# Altium project H19R1.PrjPcb
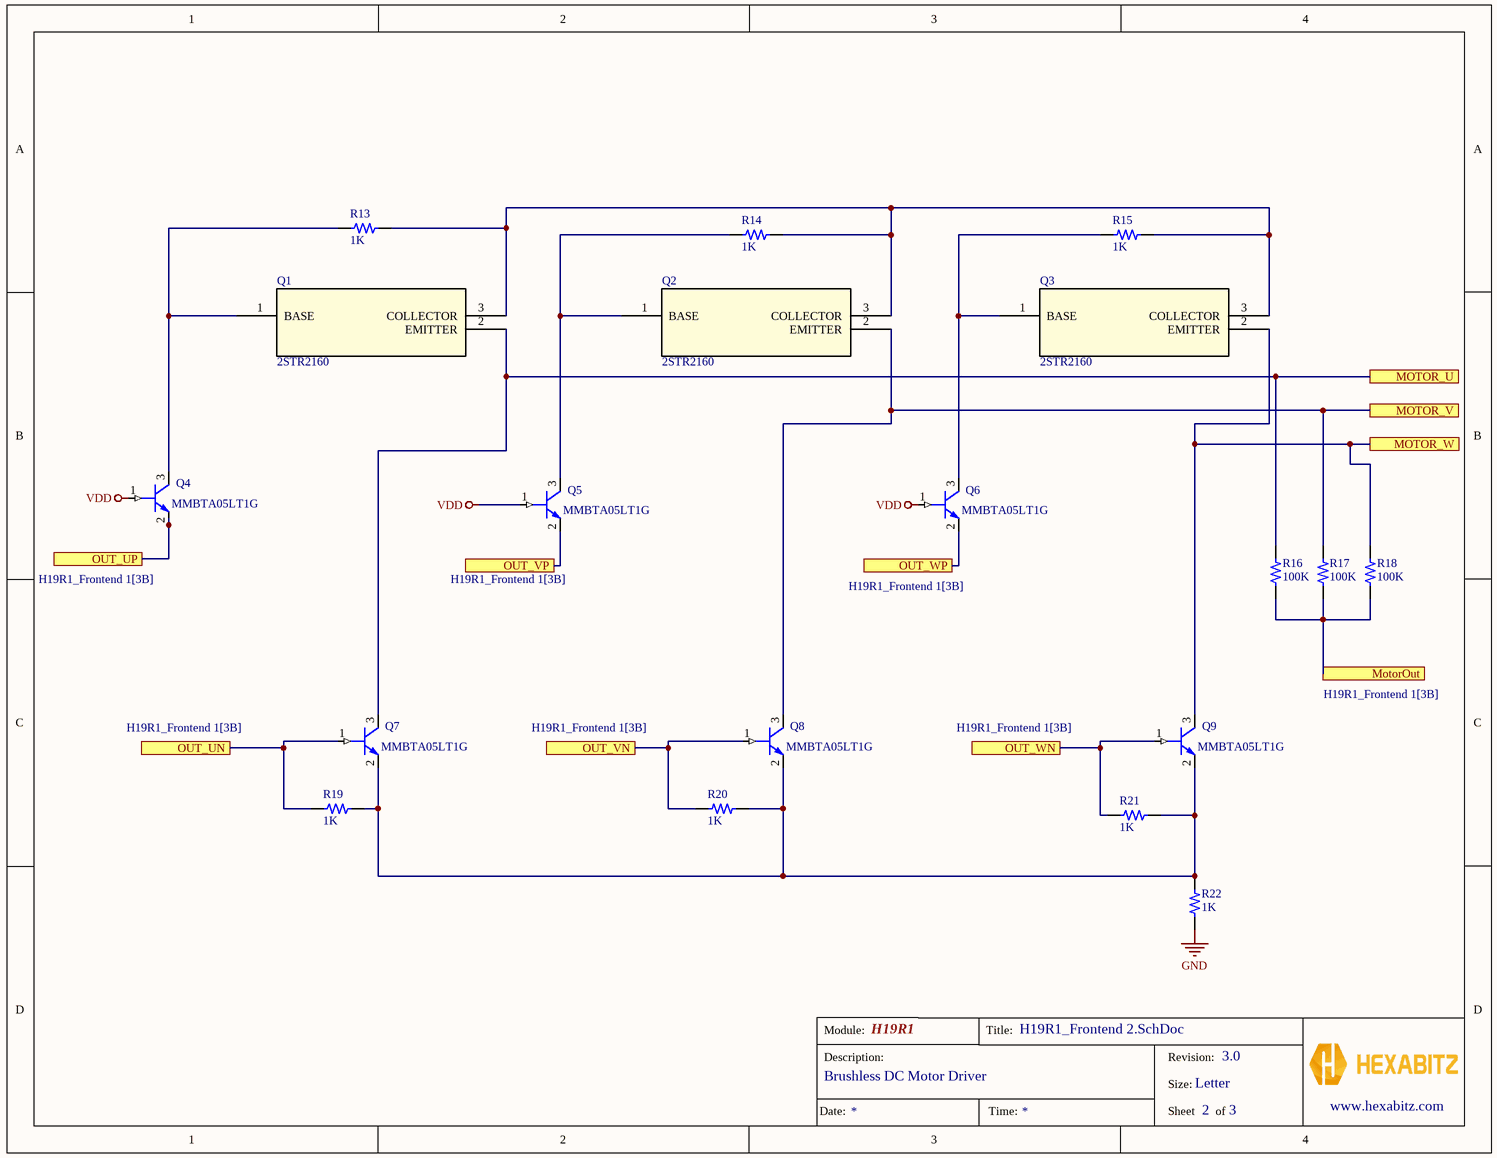
[diagram p0: H19R1_Frontend 2.SchDoc]
revision: 3.0; Module_Name: H19R1; Module_Description: Brushless DC Motor Driver
1 sheet, 19 parts. Net scope: flat (ports and power ports of the same name join across sheets).
Board file: H19R1.PcbDoc

## Sheet H19R1_Frontend 2.SchDoc
size Letter; CompanyName: Hexabitz; DocumentNumber: 2; SheetNumber: 2; SheetTotal: 3

### Parts
Q1  2STR2160  [SOT23_3P04X1P75X1P9_STM]
Q2  2STR2160  [SOT23_3P04X1P75X1P9_STM]
Q3  2STR2160  [SOT23_3P04X1P75X1P9_STM]
Q4  MMBTA05LT1G  [SOT-23]
Q5  MMBTA05LT1G  [SOT-23]
Q6  MMBTA05LT1G  [SOT-23]
Q7  MMBTA05LT1G  [SOT-23]
Q8  MMBTA05LT1G  [SOT-23]
Q9  MMBTA05LT1G  [SOT-23]
R13  value 1K  [R0402_3]  (hidden comment: RC0402FR-071KL)
R14  value 1K  [R0402_3]  (hidden comment: RC0402FR-071KL)
R15  value 1K  [R0402_3]  (hidden comment: RC0402FR-071KL)
R16  value 100K  [R0402_3]  (hidden comment: ERJ-2RKF1003X)
R17  value 100K  [R0402_3]  (hidden comment: ERJ-2RKF1003X)
R18  value 100K  [R0402_3]  (hidden comment: ERJ-2RKF1003X)
R19  value 1K  [R0402_3]  (hidden comment: RC0402FR-071KL)
R20  value 1K  [R0402_3]  (hidden comment: RC0402FR-071KL)
R21  value 1K  [R0402_3]  (hidden comment: RC0402FR-071KL)
R22  value 1K  [R0402_3]  (hidden comment: RC0402FR-071KL)

### Ports
MOTOR_U, MOTOR_V, MOTOR_W, MotorOut (see H19R1_Frontend 1[3B]), OUT_UN (see H19R1_Frontend 1[3B]), OUT_UP (see H19R1_Frontend 1[3B]), OUT_VN (see H19R1_Frontend 1[3B]), OUT_VP (see H19R1_Frontend 1[3B]), OUT_WN (see H19R1_Frontend 1[3B]), OUT_WP (see H19R1_Frontend 1[3B])

### Nets
GND: R22.1
VDD: Q4.1(BASE) Q5.1(BASE) Q6.1(BASE)
MOTOR_U: Q1.2(EMITTER) Q7.3(COLLECTOR) R16.2 ; port MOTOR_U
MOTOR_V: Q2.2(EMITTER) Q8.3(COLLECTOR) R17.2 ; port MOTOR_V
MOTOR_W: Q3.2(EMITTER) Q9.3(COLLECTOR) R18.2 ; port MOTOR_W
MotorOut: R16.1 R17.1 R18.1 ; port MotorOut
OUT_UN: Q7.1(BASE) R19.1 ; port OUT_UN
OUT_UP: Q4.2(EMITTER) ; port OUT_UP
OUT_VN: Q8.1(BASE) R20.1 ; port OUT_VN
OUT_VP: Q5.2(EMITTER) ; port OUT_VP
OUT_WN: Q9.1(BASE) R21.1 ; port OUT_WN
OUT_WP: Q6.2(EMITTER) ; port OUT_WP
NetQ1_1: Q1.1(BASE) Q4.3(COLLECTOR) R13.1
NetQ1_3: Q1.3(COLLECTOR) Q2.3(COLLECTOR) Q3.3(COLLECTOR) R13.2 R14.2 R15.2
NetQ2_1: Q2.1(BASE) Q5.3(COLLECTOR) R14.1
NetQ3_1: Q3.1(BASE) Q6.3(COLLECTOR) R15.1
NetQ7_2: Q7.2(EMITTER) Q8.2(EMITTER) Q9.2(EMITTER) R19.2 R20.2 R21.2 R22.2

### Notes on the sheet
- Module:
- Title:
- Description:
- Size:
- Revision:
- Letter
- www.hexabitz.com
- Date:
- Time:
- Sheet
- of

### Library data of the parts
Q1-Q3 = 2STR2160: Low voltage fast-switching PNP power transistor; Manufacturer_Name: STMicroelectronics; Copyright: Copyright (C) 2025 Ultra Librarian. All rights reserved.; Manufacturer_Part_Number: 2STR2160; Datasheet: https://www.st.com/resource/en/datasheet/2str2160.pdf; RefDes: RefDes; Type: Type
Q4-Q9 = MMBTA05LT1G: ON Semi MMBTA05LT1G NPN Bipolar Transistor; 0.5 A; 60 V; 3-Pin SOT-23; Manufacturer: ON Semiconductor; Library: Hexabitz; Supplier: Digikey; Supplier Part Number: MMBTA05LT1GOSDKR-ND; RoHS: Yes; Category: BJTs; Stock: 21706; Pricing: 1=0.19, 10=0.113, 100=0.07, 500=0.05098, 1000=0.0448 (USD); ComponentLink1URL: https://datasheet.ciiva.com/976/mmbta05lt1-d-976497.pdf?src-supplier=Digikey; ComponentLink1Description: https://datasheet.ciiva.com/976/mmbta05lt1-d-976497.pdf?src-supplier=Digikey; ComponentLink2URL: https://datasheet.ciiva.com/976/mmbta05lt1-d-976498.pdf?src-supplier=Digikey; ComponentLink2Description: https://datasheet.ciiva.com/976/mmbta05lt1-d-976498.pdf?src-supplier=Digikey; ComponentLink3URL: https://datasheet.ciiva.com/976/mmbta05lt1-d-976499.pdf?src-supplier=Digikey; ComponentLink3Description: https://datasheet.ciiva.com/976/mmbta05lt1-d-976499.pdf?src-supplier=Digikey; ComponentLink4URL: https://datasheet.ciiva.com/11204/mmbta05lt1-d-11204053.pdf?src-supplier=Avnet; ComponentLink4Description: https://datasheet.ciiva.com/11204/mmbta05lt1-d-11204053.pdf?src-supplier=Avnet; ComponentLink5URL: https://datasheet.ciiva.com/16507/mmbta05lt1-d-16507334.pdf?src-supplier=Future+Electronics; ComponentLink5Description: https://datasheet.ciiva.com/16507/mmbta05lt1-d-16507334.pdf?src-supplier=Future+Electronics; Supplier 1: Digikey; Supplier Part Number 1: MMBTA05LT1GOSDKR-ND; Manufacturer Part Number: MMBTA05LT1G
R13-R15 R19-R22 = RC0402FR-071KL: SMD Chip Resistor 1 Kohm ½ 1% 62.5 Mw 0402 [1005 Metric] Thick Film General Purpose; Manufacturer: Yageo; Voltage Rating (DC): 50V; Temperature Coefficient: 100ppm/°C; Power Rating: 62.5mW; Max Power Dissipation: 63mW; Library: Hexabitz; Supplier: Digikey; Supplier Part Number: 311-1.00KLRDKR-ND; Manufacturer Part Number: RC0402FR-071KL; RoHS: Yes; Category: Chip SMD Resistors; Stock: 2438980; Pricing: 1=0.1, 10=0.007, 100=0.0061, 1000=0.0051, 2500=0.00408 (USD); Case/Package: 0402; Pins: 2; Case Code (Imperial): 0402; Case Code (Metric): 1005; Min Operating Temperature: -55°C; Max Operating Temperature: 155°C; Tolerance: 1%; Packaging: Tape and Reel; Resistor Type: Thick Film; Voltage Rating: 50V; Termination: SMD/SMT; Features: Moisture Resistant; Series: RC; Number of Terminations: 2; Resistance Tolerance: 1%; Construction: Rectangular; Technology: THICK FILM; Voltage Rating (AC): 50V; Length: 1mm; Width: 0.5mm; Height: 0.32mm; Depth: 0.5mm; Reach SVHC Compliant: No; Lead Free: 5697LeadFree; Military Standard: Not; RoHS Compliant: Yes; ComponentLink1URL: https://datasheet.ciiva.com/11819/0900766b80c66297-11819477.pdf?src-supplier=Rs; ComponentLink1Description: https://datasheet.ciiva.com/11819/0900766b80c66297-11819477.pdf?src-supplier=Rs; ComponentLink2URL: https://datasheet.ciiva.com/7983/1018594-7983502.pdf?src-supplier=Element14; ComponentLink2Description: https://datasheet.ciiva.com/7983/1018594-7983502.pdf?src-supplier=Element14; ComponentLink3URL: https://datasheet.ciiva.com/22747/1018594-22747513.pdf?src-supplier=Element14; ComponentLink3Description: https://datasheet.ciiva.com/22747/1018594-22747513.pdf?src-supplier=Element14; ComponentLink4URL: https://datasheet.ciiva.com/12666/pyu-rc0402-51-rohs-l-6-r-12666741.pdf?src-supplier=Mouser; ComponentLink4Description: https://datasheet.ciiva.com/12666/pyu-rc0402-51-rohs-l-6-r-12666741.pdf?src-supplier=Mouser; ComponentLink5URL: https://datasheet.ciiva.com/7849/1018594-7849869.pdf?src-supplier=Element14; ComponentLink5Description: https://datasheet.ciiva.com/7849/1018594-7849869.pdf?src-supplier=Element14; ComponentLink6URL: https://datasheet.ciiva.com/7849/1018594-7849871.pdf?src-supplier=Element14; ComponentLink6Description: https://datasheet.ciiva.com/7849/1018594-7849871.pdf?src-supplier=Element14; ComponentLink7URL: https://datasheet.ciiva.com/17063/pyu-rc0402-51-rohs-l-6-r-17063193.pdf?src-supplier=Future+Electronics; ComponentLink7Description: https://datasheet.ciiva.com/17063/pyu-rc0402-51-rohs-l-6-r-17063193.pdf?src-supplier=Future+Electronics; Supplier 1: Digikey; Supplier Part Number 1: 311-1.00KLRDKR-ND
R16-R18 = ERJ-2RKF1003X: Res Thick Film 0402 100K Ohm 1% 1/10W ±100ppm/°C Molded SMD Punched Carrier T/R; Manufacturer: Panasonic; Power Rating: 100mW; Voltage Rating: 50V; Library: Hexabitz; Supplier: Digikey; Supplier Part Number: P100KLCT-ND; Manufacturer Part Number: ERJ-2RKF1003X; RoHS: Yes; Category: Chip SMD Resistors; Stock: 3425412; Pricing: 1=0.1, 10=0.028, 100=0.0138, 1000=0.00766, 2500=0.00632, 5000=0.00554 (USD); Case Code (Imperial): 0402; Case Code (Metric): 1005; Weight: 0.000388oz; Min Operating Temperature: -55°C; Max Operating Temperature: 155°C; Tolerance: 1%; Packaging: Cut Tape; Package Quantity: 10000; Termination: SMD/SMT; Temperature Coefficient: 100ppm/°C; Series: ERJ-2Rx; Technology: THICK FILM; Voltage Rating (DC): 50V; Length: 1mm; Width: 0.5mm; Height: 0.35mm; RoHS Compliant: Yes; ComponentLink1URL: https://datasheet.ciiva.com/34303/1987038-34303550.pdf?src-supplier=Jameco; ComponentLink1Description: https://datasheet.ciiva.com/34303/1987038-34303550.pdf?src-supplier=Jameco; ComponentLink2URL: https://datasheet.ciiva.com/11821/0900766b80f80784-11821175.pdf?src-supplier=Rs; ComponentLink2Description: https://datasheet.ciiva.com/11821/0900766b80f80784-11821175.pdf?src-supplier=Rs; ComponentLink3URL: https://datasheet.ciiva.com/7830/aoa0000ce2-7830725.pdf?src-supplier=Element14; ComponentLink3Description: https://datasheet.ciiva.com/7830/aoa0000ce2-7830725.pdf?src-supplier=Element14; ComponentLink4URL: https://datasheet.ciiva.com/7830/426256-7830974.pdf?src-supplier=Element14; ComponentLink4Description: https://datasheet.ciiva.com/7830/426256-7830974.pdf?src-supplier=Element14; ComponentLink5URL: https://datasheet.ciiva.com/43467/1678782-43467480.pdf?src-supplier=Farnell; ComponentLink5Description: https://datasheet.ciiva.com/43467/1678782-43467480.pdf?src-supplier=Farnell; ComponentLink6URL: https://datasheet.ciiva.com/22723/426256-22723902.pdf?src-supplier=Element14; ComponentLink6Description: https://datasheet.ciiva.com/22723/426256-22723902.pdf?src-supplier=Element14; ComponentLink7URL: https://datasheet.ciiva.com/16778/70260748-16778055.pdf?src-supplier=Allied+Electronics; ComponentLink7Description: https://datasheet.ciiva.com/16778/70260748-16778055.pdf?src-supplier=Allied+Electronics; ComponentLink8URL: https://datasheet.ciiva.com/16784/70260748-16784190.pdf?src-supplier=Allied+Electronics; ComponentLink8Description: https://datasheet.ciiva.com/16784/70260748-16784190.pdf?src-supplier=Allied+Electronics; Supplier 1: Digikey; Supplier Part Number 1: P100KLDKR-ND